# EAGLE design TB6560 (EAGLE 5.06)
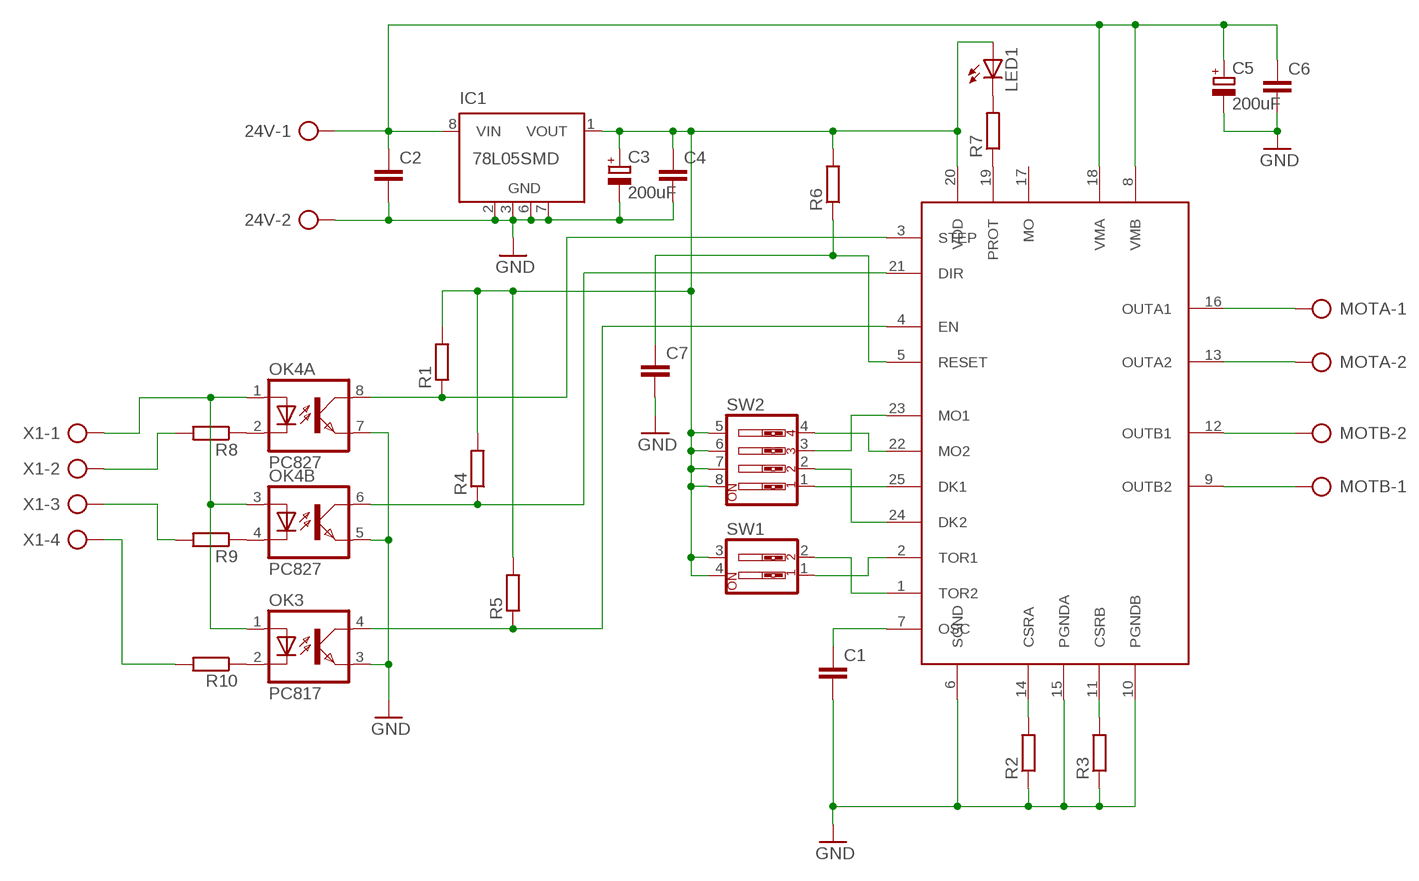
[diagram p0: schematic, sheet 1]

## Parts
24V  AK500/2  [AK500/2]
C1  C-EUC1206  [C1206]
C2  C-EUC1206  [C1206]
C3  200uF  CPOL-EUE5-8.5  [E5-8,5]
C4  C-EUC1206  [C1206]
C5  200uF  CPOL-EUE5-8.5  [E5-8,5]
C6  C-EUC1206  [C1206]
C7  C-EUC1206  [C1206]
IC1  78L05SMD  [SO08]
LED1  LED3MM  [LED3MM]
MOTA  AK500/2  [AK500/2]
MOTB  AK500/2  [AK500/2]
OK3  PC817  [DIL04]
OK4  PC827  [DIL08]
R1  R-EU_M1206  [M1206]
R2  R-EU_0817/22  [P0817/22]
R3  R-EU_0817/22  [P0817/22]
R4  R-EU_M1206  [M1206]
R5  R-EU_M1206  [M1206]
R6  R-EU_M1206  [M1206]
R7  R-EU_M1206  [M1206]
R8  R-EU_M1206  [M1206]
R9  R-EU_M1206  [M1206]
R10  R-EU_M1206  [M1206]
SW1  SW_DIP-2  [EDG-02]
SW2  SW_DIP-4  [EDG-04]
U$1  TB6560SMD  [ZIPSMD]
X1  AK500/4  [AK500/4]

## Nets
GND: 24V.2 C1.2 C2.2 C3.- C4.2 C5.- C6.2 C7.2 IC1.2(GND) IC1.3(GND) IC1.6(GND) IC1.7(GND) OK3.3(EMIT) OK4.5(B:EMIT) OK4.7(A:EMIT) R2.1 R3.1 U$1.6(SGND) U$1.10(PGNDB) U$1.15(PGNDA)
N$1: MOTA.2 U$1.13(OUTA2)
N$2: MOTA.1 U$1.16(OUTA1)
N$3: MOTB.2 U$1.12(OUTB1)
N$4: MOTB.1 U$1.9(OUTB2)
N$5: SW2.3 U$1.23(MO1)
N$6: SW2.4 U$1.22(MO2)
N$7: SW2.2 U$1.24(DK2)
N$8: SW2.1 U$1.25(DK1)
N$9: SW1.2 U$1.1(TOR2)
N$10: C7.1 R6.1 U$1.5(RESET)
N$11: C1.1 U$1.7(OSC)
N$12: R2.2 U$1.14(CSRA)
N$13: R3.2 U$1.11(CSRB)
N$14: SW1.1 U$1.2(TOR1)
N$15: OK4.8(A:COL) R1.1 U$1.3(STEP)
N$16: OK4.6(B:COL) R4.1 U$1.21(DIR)
N$17: OK3.4(COL) R5.1 U$1.4(EN)
N$18: 24V.1 C2.1 C5.+ C6.1 IC1.8(VIN) U$1.8(VMB) U$1.18(VMA)
N$19: R7.1 U$1.19(PROT)
N$20: OK3.1(A) OK4.1(A:A) OK4.3(B:A) X1.1
N$21: OK4.2(A:C) R8.1
N$22: LED1.K(C) R7.2
N$23: C3.+ C4.1 IC1.1(VOUT) LED1.A R1.2 R4.2 R5.2 R6.2 SW1.3 SW1.4 SW2.5 SW2.6 SW2.7 SW2.8 U$1.20(VDD)
N$24: OK4.4(B:C) R9.1
N$26: OK3.2(C) R10.1
N$27: R10.2 X1.4
N$28: R9.2 X1.3
N$29: R8.2 X1.2
Unconnected: IC1.4(NC) IC1.5(NC) U$1.17(MO)

## Library data of the parts
24V MOTA MOTB = con-ptr500:AK500/2: CONNECTOR
C1 C2 C4 C6 C7 = rcl:C-EU: CAPACITOR, European symbol
C3 C5 = rcl:CPOL-EU: POLARIZED CAPACITOR, European symbol
IC1 = linear:78L*SMD: Positive VOLTAGE REGULATOR
LED1 = led:LED: LED OSRAM: - CHIPLED LG R971, LG N971, LY N971, LG Q971, LY Q971, LO R971, LY R971 LH N974, LH R974 LS Q976, LO Q976, LY Q976 LO Q996 - Hyper CHIPLED LW Q18S LB Q993, LB Q99A, LB R99A - SideLED LS A670, LO A670, LY A670, LG A670, LP A670 LB A673, LV A673, LT A673, LW A673 LH A674 LY A675 LS A676, LA A676, LO A676, LY A676, LW A676 LS A679, LY A679, LG A679 - Hyper Micro SIDELED® LS Y876, LA Y876, LO Y876, LY Y876 LT Y87S - SmartLED LW L88C, LW L88S LB L89C, LB L89S, LG L890 LS L89K, LO L89K, LY L89K LS L896, LA L896, LO L896, LY L896 - TOPLED LS T670, LO T670, LY T670, LG T670, LP T670 LSG T670, LSP T670, LSY T670, LOP T670, LYG T670 LG T671, LOG T671, LSG T671 LB T673, LV T673, LT T673, LW T673 LH T674 LS T676, LA T676, LO T676, LY T676, LB T676, LH T676, LSB T676, LW T676 LB T67C, LV T67C, LT T67C, LS T67K, LO T67K, LY T67K, LW E67C LS E67B, LA E67B, LO E67B, LY E67B, LB E67C, LV E67C, LT E67C LW T67C LS T679, LY T679, LG T679 LS T770, LO T770, LY T770, LG T770, LP T770 LB T773, LV T773, LT T773, LW T773 LH T774 LS E675, LA E675, LY E675, LS T675 LS T776, LA T776, LO T776, LY T776, LB T776 LHGB T686 LT T68C, LB T68C - Hyper Mini TOPLED® LB M676 - Mini TOPLED Santana® LG M470 LS M47K, LO M47K, LY M47K Source: http://www.osram.convergy.de LUXEON: - LUMILED® LXK2-PW12-R00, LXK2-PW12-S00, LXK2-PW14-U00, LXK2-PW14-V00 LXK2-PM12-R00, LXK2-PM12-S00, LXK2-PM14-U00 LXK2-PE12-Q00, LXK2-PE12-R00, LXK2-PE12-S00, LXK2-PE14-T00, LXK2-PE14-U00 LXK2-PB12-K00, LXK2-PB12-L00, LXK2-PB12-M00, LXK2-PB14-N00, LXK2-PB14-P00, LXK2-PB14-Q00 LXK2-PR12-L00, LXK2-PR12-M00, LXK2-PR14-Q00, LXK2-PR14-R00 LXK2-PD12-Q00, LXK2-PD12-R00, LXK2-PD12-S00 LXK2-PH12-R00, LXK2-PH12-S00 LXK2-PL12-P00, LXK2-PL12-Q00, LXK2-PL12-R00 Source: www.luxeon.com KINGBRIGHT: KA-3528ASYC Source: www.kingbright.com
OK3 = optocoupler:PC817: SHARP OPTO COUPLER
OK4 = optocoupler:PC827: SHARP OPTO COUPLER
R1-R10 = rcl:R-EU_: RESISTOR, European symbol
SW1 = special:SW_DIP-2: DIP SWITCH
SW2 = special:SW_DIP-4: DIP SWITCH
U$1 = TB6560:TB6560
X1 = con-ptr500:AK500/4: CONNECTOR

## Board
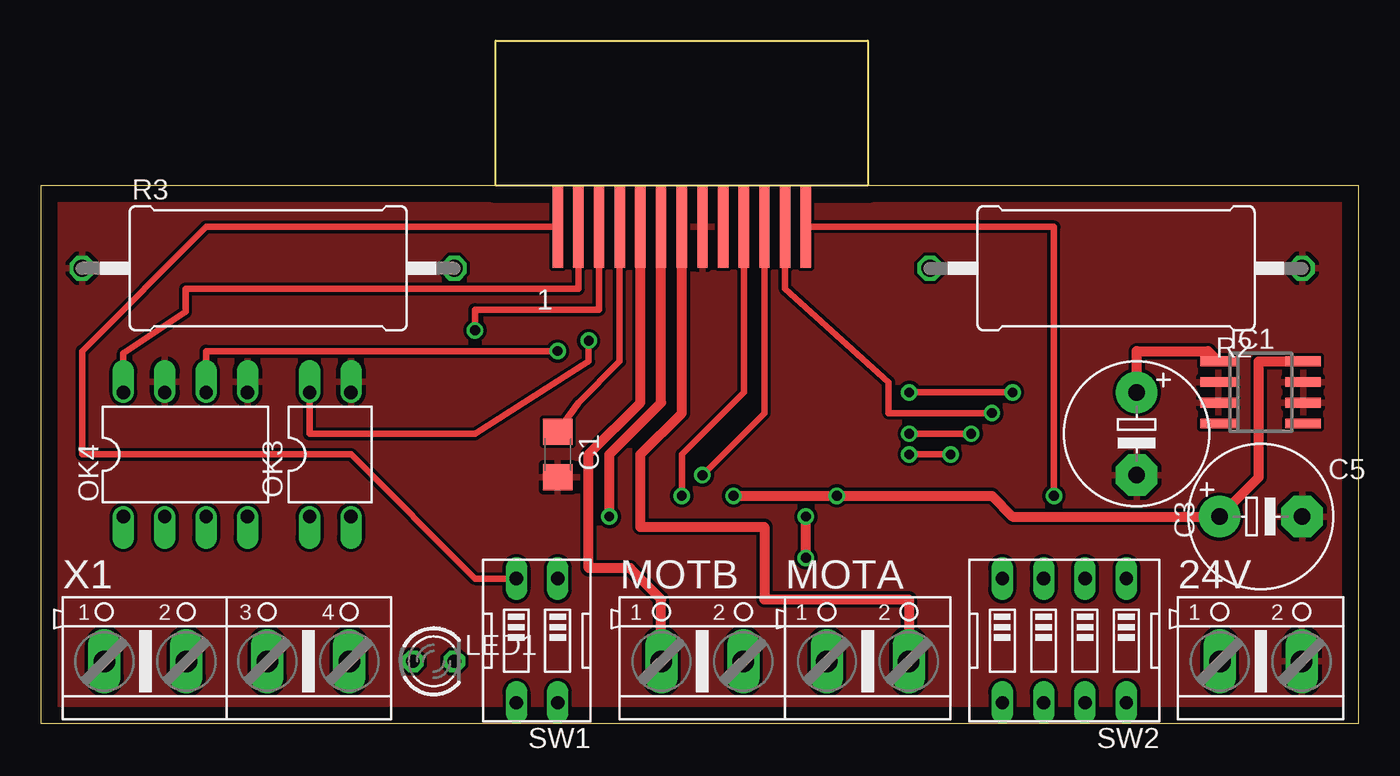
[diagram p1: board, top side]
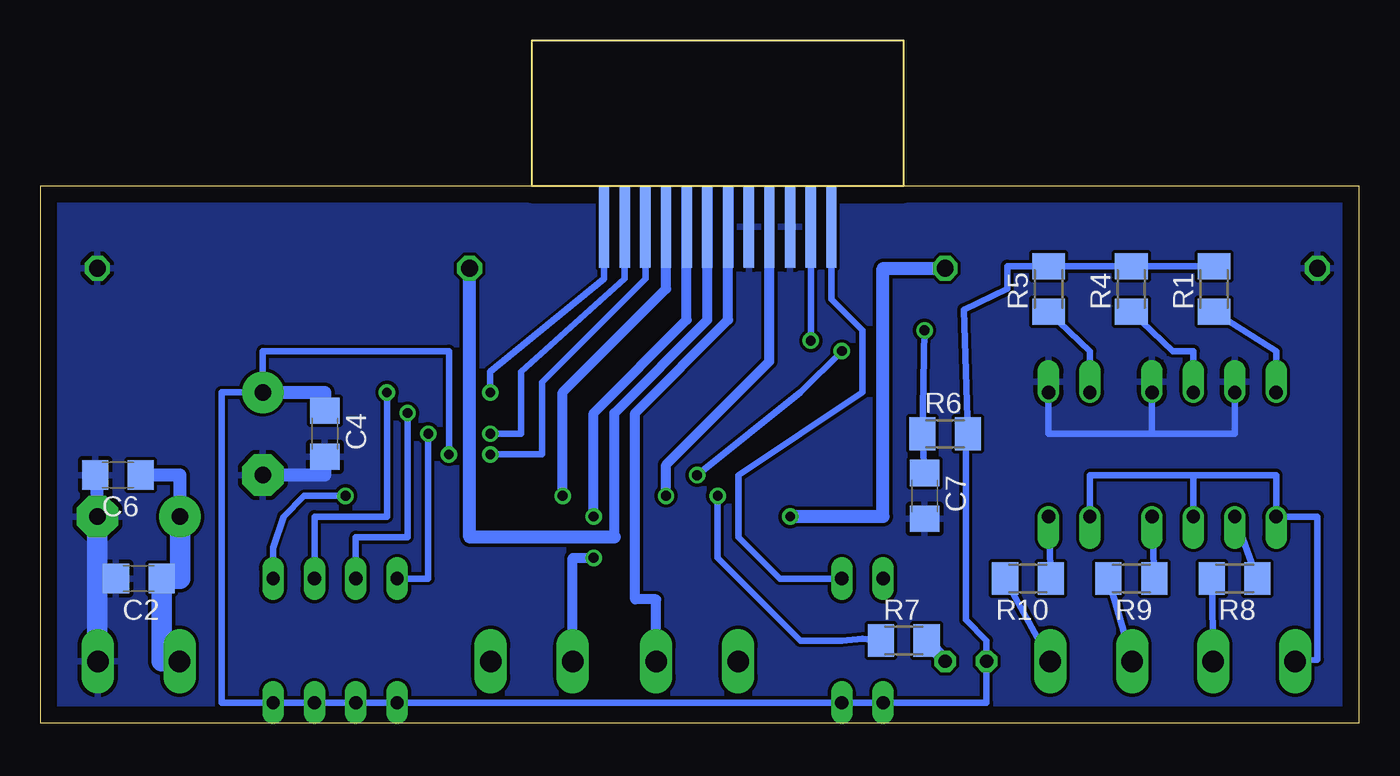
[diagram p2: board, bottom side, seen from below]

Size 80.95 x 33.01 mm. Coordinates in mm from the lower left corner, seen from the top.
Outline: 0,0 80.95,0 80.95,33.01 0,33.01 0,0
Copper layers (1*16): Top 0.035mm / dielectric 1.5mm / Bottom 0.035mm
Design rules "default": minimum track width 10mil, minimum drill 24mil, track to track 8mil, track to pad 8mil, pad to pad 8mil, via to via 8mil, smd to smd 8mil, copper to edge 40mil, drill to drill 8mil, minimum pad ring 10mil, minimum via ring 8mil, stop-mask expansion 4mil, vias tented up to drill 0mil, thermal gap 10mil

### Footprints (pad centres in the part's own frame; a part is rotated, then mirrored left to right if it is on the bottom)
AK500/2 = drill 1.321 long: 1 -2.515,0; 2 2.515,0
C1206 = smd 1.6 x 1.8: 1 -1.4,0; 2 1.4,0
E5-8,5 = drill 1.016 pad 2.54 round: + -2.54,0 | drill 1.016 pad 2.54 octagon: - 2.54,0
SO08 = smd 0.6 x 2.2: 1 -1.905,-2.6; 2 -0.635,-2.6; 3 0.635,-2.6; 4 1.905,-2.6; 5 1.905,2.6; 6 0.635,2.6; 7 -0.635,2.6; 8 -1.905,2.6
LED3MM = drill 0.813 octagon: A -1.27,0; K 1.27,0
DIL04 = drill 0.813 offset: 1 -1.27,-3.81; 2 1.27,-3.81; 3 1.27,3.81; 4 -1.27,3.81
DIL08 = drill 0.813 offset: 1 -3.81,-3.81; 2 -1.27,-3.81; 3 1.27,-3.81; 4 3.81,-3.81; 5 3.81,3.81; 6 1.27,3.81; 7 -1.27,3.81; 8 -3.81,3.81
M1206 = smd 1.6 x 2: 1 -1.4,0; 2 1.4,0
P0817/22 = drill 1.016 octagon: 1 -11.43,0; 2 11.43,0
EDG-02 = drill 0.813 long: 1 -1.27,-3.81; 2 1.27,-3.81; 3 1.27,3.81; 4 -1.27,3.81
EDG-04 = drill 0.813 long: 1 -3.81,-3.81; 2 -1.27,-3.81; 3 1.27,-3.81; 4 3.81,-3.81; 5 3.81,3.81; 6 1.27,3.81; 7 -1.27,3.81; 8 -3.81,3.81
ZIPSMD = smd 0.635 x 5: 1 -7.62,0; 3 -6.35,0; 5 -5.08,0; 7 -3.81,0; 9 -2.54,0; 11 -1.27,0; 13 0,0; 15 1.27,0; 17 2.54,0; 19 3.81,0; 21 5.08,0; 23 6.35,0; 25 7.62,0 | smd 0.635 x 5 bottom: 2 -6.985,0; 4 -5.715,0; 6 -4.445,0; 8 -3.175,0; 10 -1.905,0; 12 -0.635,0; 14 0.635,0; 16 1.905,0; 18 3.175,0; 20 4.445,0; 22 5.715,0; 24 6.985,0
AK500/4 = drill 1.321 long: 1 -7.518,0; 2 -2.489,0; 3 2.489,0; 4 7.518,0

### Placement (x,y rotation side)
24V  74.93,3.81 0 top
C1  31.75,16.51 270 top
C2  74.93,8.89 180 bottom
C3  67.31,17.78 270 top
C4  63.5,17.78 270 bottom
C5  74.93,12.7 0 top
C6  76.2,15.24 180 bottom
C7  26.67,13.97 270 bottom
IC1  74.93,20.32 270 top
LED1  24.13,3.81 0 top
MOTA  50.8,3.81 0 top
MOTB  40.64,3.81 0 top
OK3  17.78,16.51 0 top
OK4  8.89,16.51 0 top
R1  8.89,26.67 90 bottom
R2  66.04,27.94 180 top
R3  13.97,27.94 0 top
R4  13.97,26.67 90 bottom
R5  19.05,26.67 90 bottom
R6  25.4,17.78 0 bottom
R7  27.94,5.08 0 bottom
R8  7.62,8.89 180 bottom
R9  13.97,8.89 180 bottom
R10  20.32,8.89 180 bottom
SW1  30.48,5.08 180 top
SW2  62.87,5.08 180 top
U$1  39.37,30.48 0 top
X1  11.43,3.81 0 top

### Tracks (layer width: path | path; a pad name or v marks a point on that pad's centre or on a via)
GND
  Bottom 0.406: OK4.7 7.62,17.78 12.7,17.78 | 12.7,17.78 OK4.5 | 12.7,17.78 19.05,17.78 OK3.3
  Bottom 0.813: C6.2 77.47,15.24 C5.- | C3.- 63.5,15.24 C4.2
  Bottom 1.27: 24V.2 77.47,3.81 77.47,8.89 | 77.47,8.89 C2.2 | 77.47,8.89 C5.-
  pour Top: 0,33.02 81.28,33.02 81.28,0 0,0
  pour Bottom: 0,33.02 81.28,33.02 81.28,0 0,0
N$1
  Top 0.61: MOTA.2 53.31,7.62 44.45,7.62 44.45,12.06 36.83,12.06 36.83,16.51 39.37,19.05 U$1.13
N$2  (via drill 0.6)
  Top 0.61: v46.99,10.16 v46.99,12.7
  Bottom 0.61: MOTA.1 48.28,10.16 v46.99,10.16 | v46.99,12.7 46.99,19.05 41.27,24.77 U$1.16
N$3
  Bottom 0.61: MOTB.2 43.16,7.62 44.45,7.62 44.45,19.05 38.73,24.77 U$1.12
N$4
  Top 0.61: U$1.9 36.83,19.68 33.66,16.51 33.66,9.53 36.2,9.53 38.1,7.62 38.1,3.83 MOTB.1
N$5  (via drill 0.6)
  Top 0.406: U$1.23 45.72,26.67 52.07,20.95 52.07,19.05 v58.42,19.05
  Bottom 0.406: v58.42,19.05 58.42,11.43 61.59,11.43 SW2.3
N$6  (via drill 0.6)
  Top 0.406: v57.15,17.78 v53.34,17.78
  Bottom 0.406: U$1.22 45.09,27.3 51.44,21.59 51.44,17.78 v53.34,17.78 | v57.15,17.78 57.15,8.89 SW2.4
N$7  (via drill 0.6)
  Top 0.406: v59.69,20.32 v53.34,20.32
  Bottom 0.406: U$1.24 46.35,27.3 53.34,21.59 v53.34,20.32 | v59.69,20.32 59.69,12.7 64.14,12.7 SW2.2
N$8  (via drill 0.6)
  Top 0.406: U$1.25 62.23,30.48 v62.23,13.97
  Bottom 0.406: v62.23,13.97 64.77,13.97 66.04,12.7 66.67,10.79 SW2.1
N$9
  Top 0.406: U$1.1 10.16,30.48 2.54,22.86 2.54,16.51 19.05,16.51 26.67,8.89 SW1.2
N$10  (via drill 0.6)
  Top 0.406: U$1.5 34.29,25.4 26.67,25.4 v26.67,24.13
  Bottom 0.406: C7.1 R6.1 v26.67,24.13
N$11
  Top 0.406: U$1.7 35.56,22.23 33.02,19.68 C1.1
N$12
  Bottom 0.61: 45.72,11.43 45.72,19.05 40.01,24.77 U$1.14
  Bottom 0.813: R2.2 54.61,11.43 45.72,11.43
N$13  (via drill 0.6)
  Top 0.61: v34.92,12.7 34.92,16.51 38.1,19.68 U$1.11
  Bottom 0.813: R3.2 29.21,27.94 29.21,12.7 v34.92,12.7
N$14
  Bottom 0.406: U$1.2 32.38,26.04 30.48,24.13 30.48,20.32 38.1,15.24 38.1,11.43 35.56,8.89 SW1.1
N$15
  Top 0.406: U$1.3 33.02,26.67 8.89,26.67 R1.1 5.08,22.73 OK4.8
  Bottom 0.406: OK4.8 5.08,22.86 R1.1
N$16  (via drill 0.6)
  Top 0.406: U$1.21 44.45,19.05 v40.64,15.24 | v31.75,22.86 10.16,22.86 OK4.6
  Bottom 0.406: OK4.6 10.16,22.86 11.43,22.86 R4.1 | v40.64,15.24 34.29,20.32 v31.75,22.86
N$17  (via drill 0.6)
  Top 0.406: v33.66,23.5 33.66,22.23 26.67,17.78 16.51,17.78 OK3.4
  Bottom 0.406: OK3.4 16.51,22.86 R5.1 | v33.66,23.5 U$1.4
N$18  (via drill 0.6)
  Top 0.61: IC1.8 74.8,22.23 C6.1 74.8,15.11 C5.+ 59.69,12.7 58.42,13.97 v48.9,13.97 v42.55,13.97
  Bottom 0.61: U$1.8 36.2,22.23 42.55,15.88 v42.55,13.97 | v48.9,13.97 48.9,20.32 42.55,26.67 U$1.18
  Bottom 0.813: C5.+ 72.39,15.24 C6.1 74.93,15.24
  Bottom 1.27: 24V.1 73.53,3.81 C2.1 72.39,8.89 C5.+
N$19  (via drill 0.6)
  Top 0.406: U$1.19 43.18,20.32 39.37,16.51 v39.37,13.97
  Bottom 0.406: v39.37,13.97 39.37,10.16 34.29,5.08 31.75,5.08 30.48,5.21 R7.1
N$20
  Bottom 0.406: X1.1 2.54,3.91 2.54,12.7 OK4.1 5.08,15.24 10.16,15.24 | 10.16,15.24 OK4.3 | 10.16,15.24 16.51,15.24 OK3.1
N$21
  Bottom 0.406: R8.1 OK4.2
N$22
  Bottom 0.813: LED1.K R7.2
N$23  (via drill 0.6)
  Top 0.406: v55.88,16.51 v53.34,16.51
  Top 0.61: IC1.1 71.69,22.86 67.31,22.86 C3.+
  Bottom 0.406: R1.2 R4.2 R5.2 21.59,28.07 21.59,26.67 24.26,25.4 R6.2 24.13,17.78 24.13,6.35 22.86,5.08 LED1.A 22.86,1.27 SW1.3 SW1.4 SW2.5 SW2.6 | SW2.6 SW2.7 SW2.8 | SW2.6 69.85,1.27 69.85,20.32 C3.+ 67.31,22.86 55.88,22.86 v55.88,16.51 | U$1.20 43.81,27.3 50.16,20.95 50.16,16.51 v53.34,16.51
  Bottom 0.813: C3.+ 63.5,20.32 C4.1
N$24
  Bottom 0.406: R9.1 OK4.4
N$26
  Bottom 0.406: R10.1 OK3.2
N$27
  Bottom 0.406: X1.4 R10.2
N$28
  Bottom 0.406: X1.3 R9.2
N$29
  Bottom 0.406: X1.2 R8.2